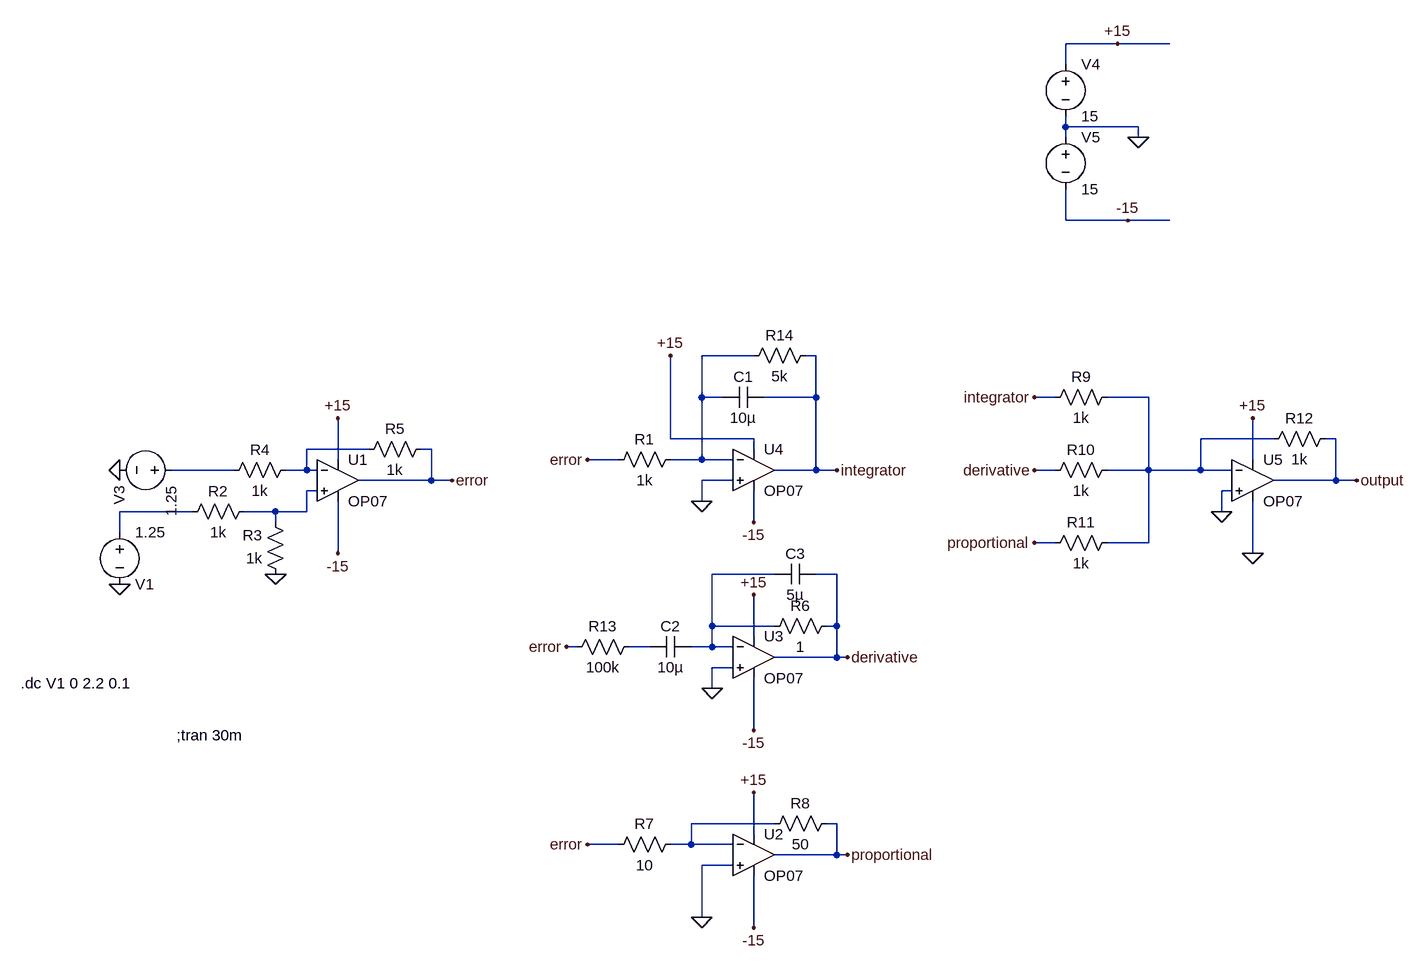
[diagram p0: schematic ELoadFanControl.asc]
ELoadFanControl.asc, the LTspice schematic file:
Version 4
SHEET 1 1072 1304
WIRE 608 -160 528 -160
WIRE 688 -160 608 -160
WIRE 528 -128 528 -160
WIRE 528 -32 528 -48
WIRE 640 -32 528 -32
WIRE 528 -16 528 -32
WIRE 640 -16 640 -32
WIRE 528 112 528 64
WIRE 624 112 528 112
WIRE 688 112 624 112
WIRE 48 320 -32 320
WIRE 144 320 128 320
WIRE -32 384 -32 320
WIRE 0 384 -32 384
WIRE 144 384 144 320
WIRE 144 384 64 384
WIRE 512 384 480 384
WIRE 656 384 592 384
WIRE -80 448 -80 320
WIRE 48 448 -80 448
WIRE 848 448 736 448
WIRE 944 448 928 448
WIRE -544 464 -640 464
WIRE -448 464 -464 464
WIRE 48 464 48 448
WIRE -592 480 -592 416
WIRE -160 480 -208 480
WIRE -32 480 -32 384
WIRE -32 480 -80 480
WIRE 16 480 -32 480
WIRE 816 480 816 416
WIRE -752 496 -848 496
WIRE -640 496 -640 464
WIRE -640 496 -672 496
WIRE -624 496 -640 496
WIRE 144 496 144 384
WIRE 144 496 80 496
WIRE 176 496 144 496
WIRE 512 496 480 496
WIRE 656 496 656 384
WIRE 656 496 592 496
WIRE 736 496 736 448
WIRE 736 496 656 496
WIRE 784 496 736 496
WIRE -448 512 -448 464
WIRE -448 512 -560 512
WIRE -416 512 -448 512
WIRE 16 512 -32 512
WIRE 944 512 944 448
WIRE 944 512 848 512
WIRE 976 512 944 512
WIRE -624 528 -640 528
WIRE 784 528 768 528
WIRE -32 544 -32 512
WIRE -816 560 -928 560
WIRE -688 560 -736 560
WIRE -640 560 -640 528
WIRE -640 560 -688 560
WIRE 768 560 768 528
WIRE -688 576 -688 560
WIRE 48 576 48 528
WIRE -928 592 -928 560
WIRE 512 608 480 608
WIRE 656 608 656 496
WIRE 656 608 592 608
WIRE -592 624 -592 544
WIRE 816 624 816 544
WIRE 80 656 -16 656
WIRE 176 656 144 656
WIRE -16 736 -16 656
WIRE 80 736 -16 736
WIRE 176 736 176 656
WIRE 176 736 160 736
WIRE 48 752 48 688
WIRE -224 768 -240 768
WIRE -112 768 -144 768
WIRE -16 768 -16 736
WIRE -16 768 -48 768
WIRE 16 768 -16 768
WIRE 176 784 176 736
WIRE 176 784 80 784
WIRE 192 784 176 784
WIRE 16 800 -16 800
WIRE -16 832 -16 800
WIRE 48 896 48 816
WIRE 80 1040 -48 1040
WIRE 176 1040 160 1040
WIRE 48 1056 48 992
WIRE -160 1072 -208 1072
WIRE -48 1072 -48 1040
WIRE -48 1072 -80 1072
WIRE 16 1072 -48 1072
WIRE 176 1088 176 1040
WIRE 176 1088 80 1088
WIRE 192 1088 176 1088
WIRE 16 1104 -32 1104
WIRE -32 1184 -32 1104
WIRE 48 1200 48 1120
FLAG -32 544 0
FLAG 640 -16 0
FLAG 608 -160 +15
FLAG 624 112 -15
FLAG -80 320 +15
FLAG 48 576 -15
FLAG -592 624 -15
FLAG -592 416 +15
FLAG 48 1200 -15
FLAG 48 992 +15
FLAG -688 656 0
FLAG -928 672 0
FLAG -416 512 error
FLAG -208 480 error
FLAG 48 896 -15
FLAG 48 688 +15
FLAG -16 832 0
FLAG -240 768 error
FLAG 192 784 derivative
FLAG -208 1072 error
FLAG -32 1184 0
FLAG 192 1088 proportional
FLAG 816 416 +15
FLAG 768 560 0
FLAG 480 384 integrator
FLAG 480 496 derivative
FLAG 480 608 proportional
FLAG 976 512 output
FLAG 176 496 integrator
FLAG -928 496 0
FLAG 816 624 0
SYMBOL OpAmps\\OP07 48 432 R0
SYMATTR InstName U4
SYMBOL res -64 464 R90
WINDOW 0 0 56 VBottom 2
WINDOW 3 32 56 VTop 2
SYMATTR InstName R1
SYMATTR Value 1k
SYMBOL cap 64 368 R90
WINDOW 0 0 32 VBottom 2
WINDOW 3 32 32 VTop 2
SYMATTR InstName C1
SYMATTR Value 10µ
SYMBOL voltage 528 -144 R0
WINDOW 123 0 0 Left 0
WINDOW 39 0 0 Left 0
SYMATTR InstName V4
SYMATTR Value 15
SYMBOL voltage 528 -32 R0
WINDOW 123 0 0 Left 0
WINDOW 39 0 0 Left 0
SYMATTR InstName V5
SYMATTR Value 15
SYMBOL OpAmps\\OP07 -592 448 R0
SYMATTR InstName U1
SYMBOL OpAmps\\OP07 48 1024 R0
SYMATTR InstName U2
SYMBOL res -720 544 R90
WINDOW 0 0 56 VBottom 2
WINDOW 3 32 56 VTop 2
SYMATTR InstName R2
SYMATTR Value 1k
SYMBOL res -672 672 R180
WINDOW 0 36 76 Left 2
WINDOW 3 36 40 Left 2
SYMATTR InstName R3
SYMATTR Value 1k
SYMBOL res -656 480 R90
WINDOW 0 0 56 VBottom 2
WINDOW 3 32 56 VTop 2
SYMATTR InstName R4
SYMATTR Value 1k
SYMBOL res -448 448 R90
WINDOW 0 0 56 VBottom 2
WINDOW 3 32 56 VTop 2
SYMATTR InstName R5
SYMATTR Value 1k
SYMBOL voltage -832 496 R90
WINDOW 0 24 96 Left 2
WINDOW 3 24 16 Left 2
WINDOW 123 0 0 Left 0
WINDOW 39 0 0 Left 0
SYMATTR InstName V3
SYMATTR Value 1.25
SYMBOL OpAmps\\OP07 48 720 R0
SYMATTR InstName U3
SYMBOL cap -48 752 R90
WINDOW 0 0 32 VBottom 2
WINDOW 3 32 32 VTop 2
SYMATTR InstName C2
SYMATTR Value 10µ
SYMBOL res 176 720 R90
WINDOW 0 0 56 VBottom 2
WINDOW 3 32 56 VTop 2
SYMATTR InstName R6
SYMATTR Value 1
SYMBOL res -64 1056 R90
WINDOW 0 0 56 VBottom 2
WINDOW 3 32 56 VTop 2
SYMATTR InstName R7
SYMATTR Value 10
SYMBOL res 176 1024 R90
WINDOW 0 0 56 VBottom 2
WINDOW 3 32 56 VTop 2
SYMATTR InstName R8
SYMATTR Value 50
SYMBOL OpAmps\\OP07 816 448 R0
SYMATTR InstName U5
SYMBOL res 608 368 R90
WINDOW 0 0 56 VBottom 2
WINDOW 3 32 56 VTop 2
SYMATTR InstName R9
SYMATTR Value 1k
SYMBOL res 608 480 R90
WINDOW 0 0 56 VBottom 2
WINDOW 3 32 56 VTop 2
SYMATTR InstName R10
SYMATTR Value 1k
SYMBOL res 608 592 R90
WINDOW 0 0 56 VBottom 2
WINDOW 3 32 56 VTop 2
SYMATTR InstName R11
SYMATTR Value 1k
SYMBOL res 944 432 R90
WINDOW 0 0 56 VBottom 2
WINDOW 3 32 56 VTop 2
SYMATTR InstName R12
SYMATTR Value 1k
SYMBOL res -128 752 R90
WINDOW 0 0 56 VBottom 2
WINDOW 3 32 56 VTop 2
SYMATTR InstName R13
SYMATTR Value 100k
SYMBOL cap 144 640 R90
WINDOW 0 0 32 VBottom 2
WINDOW 3 32 32 VTop 2
SYMATTR InstName C3
SYMATTR Value 5µ
SYMBOL res 144 304 R90
WINDOW 0 0 56 VBottom 2
WINDOW 3 32 56 VTop 2
SYMATTR InstName R14
SYMATTR Value 5k
SYMBOL voltage -928 576 R0
WINDOW 0 24 96 Left 2
WINDOW 3 24 16 Left 2
WINDOW 123 0 0 Left 0
WINDOW 39 0 0 Left 0
SYMATTR InstName V1
SYMATTR Value 1.25
TEXT -840 904 Left 2 !;tran 30m
TEXT -1080 824 Left 2 !.dc V1 0 2.2 0.1

The netlist it stands for:
* ELoadFanControl.asc
XU4 0 N001 +15 -15 integrator LT1001  ; OP07, pins In+ In- V+ V- OUT
R1 N001 error 1k
C1 integrator N001 10µ
V4 +15 0 15
V5 0 -15 15
XU1 N005 N003 +15 -15 error LT1001  ; OP07, pins In+ In- V+ V- OUT
XU2 0 N009 +15 -15 proportional LT1001  ; OP07, pins In+ In- V+ V- OUT
R2 N005 N006 1k
R3 0 N005 1k
R4 N003 N004 1k
R5 error N003 1k
V3 N004 0 1.25
XU3 0 N007 +15 -15 derivative LT1001  ; OP07, pins In+ In- V+ V- OUT
C2 N007 N008 10µ
R6 derivative N007 1
R7 N009 error 10
R8 proportional N009 50
XU5 0 N002 +15 0 output LT1001  ; OP07, pins In+ In- V+ V- OUT
R9 N002 integrator 1k
R10 N002 derivative 1k
R11 N002 proportional 1k
R12 output N002 1k
R13 N008 error 100k
C3 derivative N007 5µ
R14 integrator N001 5k
V1 N006 0 1.25
;tran 30m
.dc V1 0 2.2 0.1
.lib LTC.lib
.backanno
.end

* Results of the author's LTspice run, read from the files saved beside the schematic
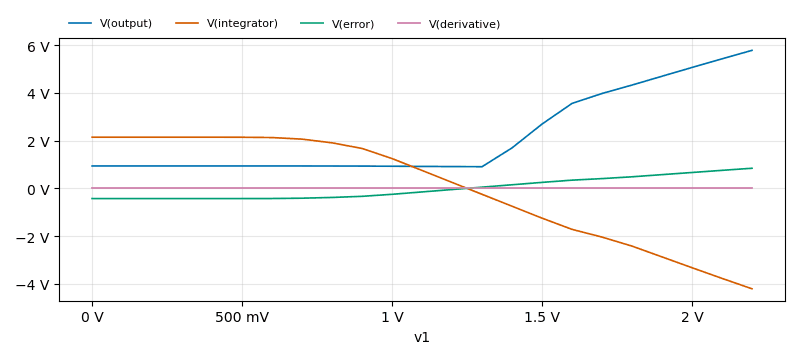
[diagram p1: DC transfer characteristic of ELoadFanControl.asc, plotted from the saved traces]
* DC transfer characteristic, 1 run:
*   V(output): 939.4 mV at v1=0 V, 5.788 V at v1=2.2 V, min 908 mV, max 5.788 V
*   V(integrator): 2.145 V at v1=0 V, -4.214 V at v1=2.2 V, min -4.214 V, max 2.145 V
*   V(error): -429.1 mV at v1=0 V, 842.7 mV at v1=2.2 V, min -429.1 mV, max 842.7 mV
*   V(derivative): 54.6 nV at v1=0 V, 2.201 nV at v1=2.2 V, min 2.201 nV, max 54.6 nV